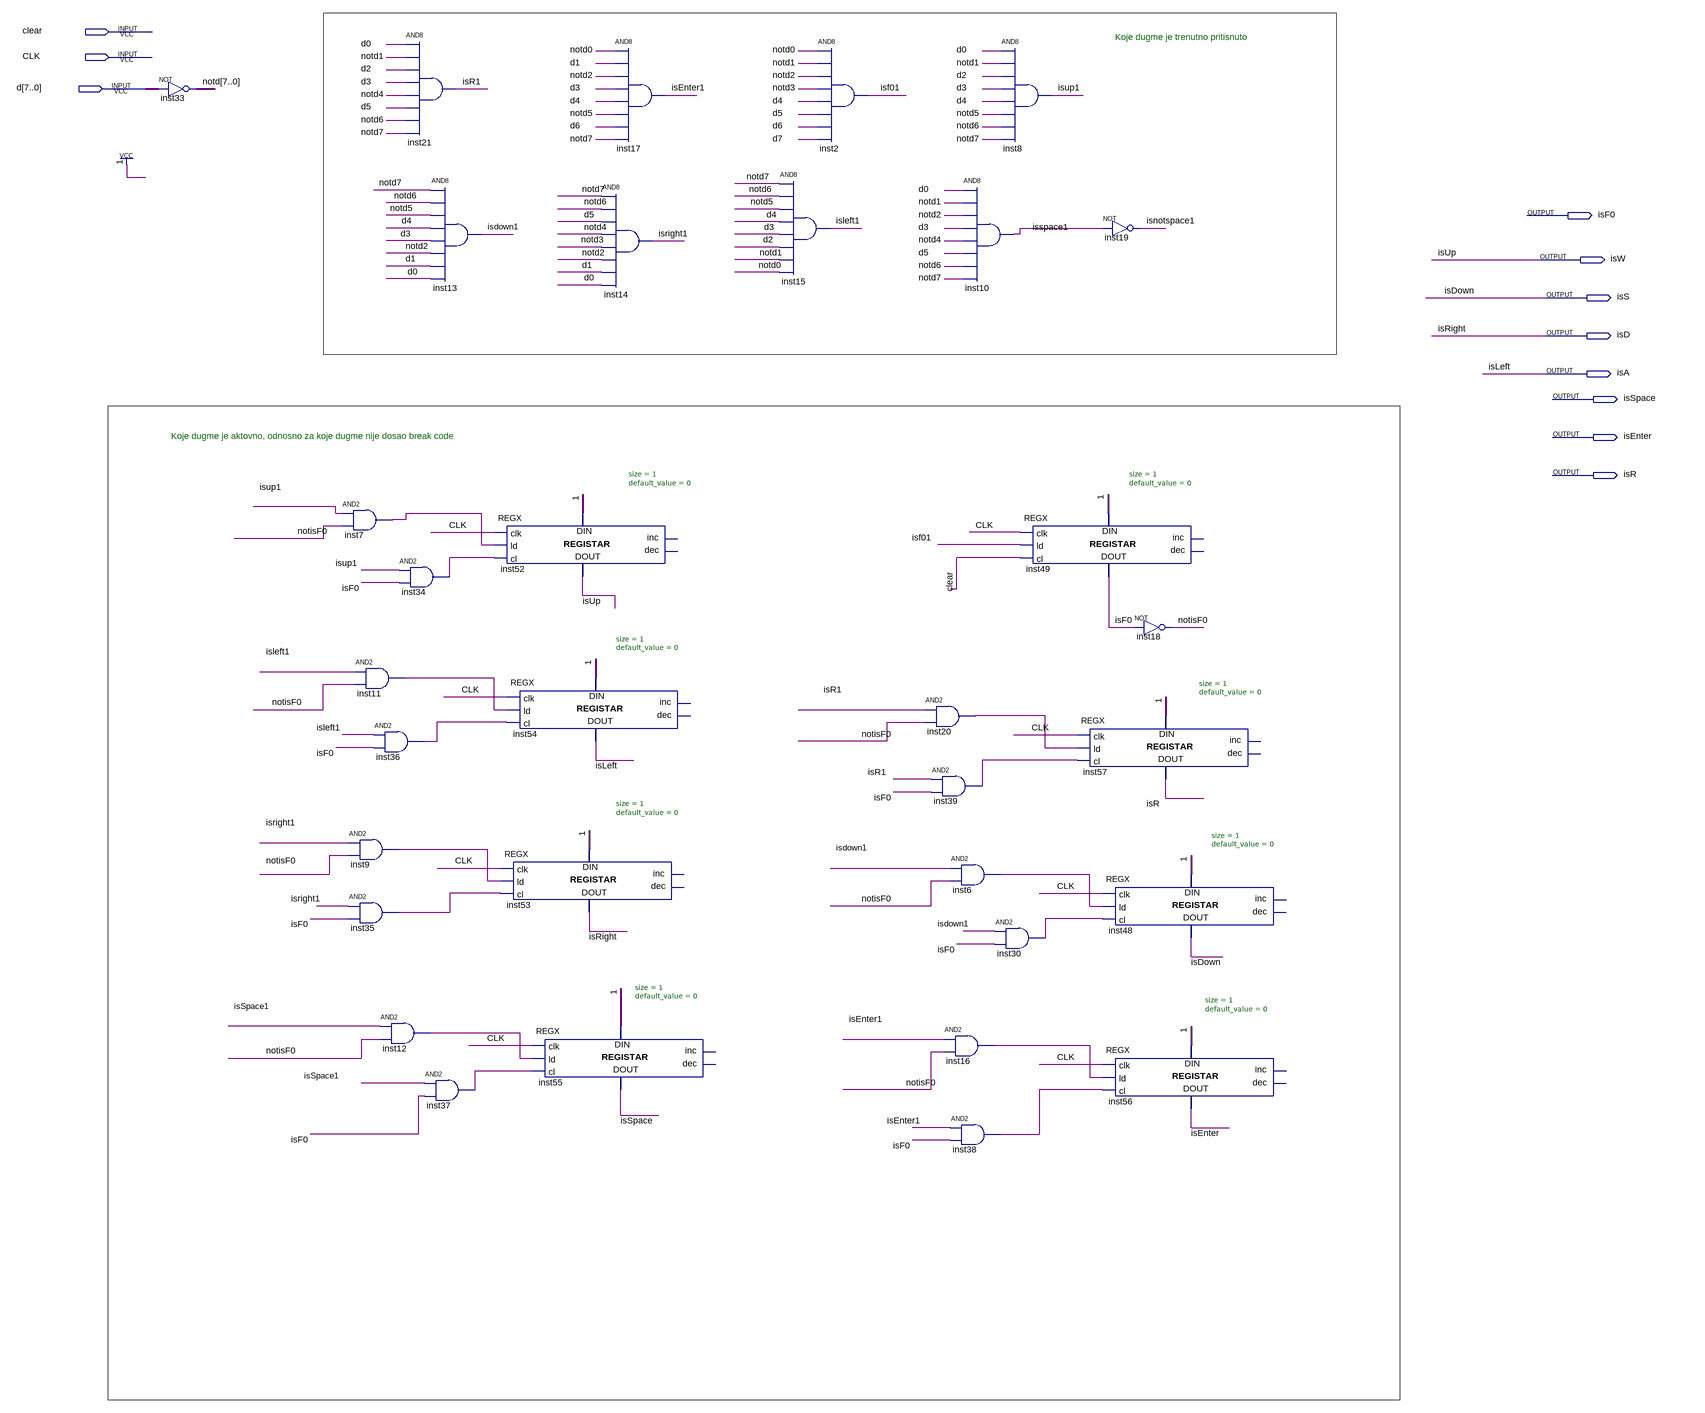
[diagram p0: schematic sheet]
// Quartus schematic KeyDetect.bdf as structural Verilog: 33 symbols, 11 pins
module KeyDetect (
  input  clear,
  input  CLK,
  input  [7:0] d,
  output isF0,
  output isW,
  output isS,
  output isD,
  output isA,
  output isSpace,
  output isEnter,
  output isR
);

  wire inst6_out, inst7_out, inst9_out, inst11_out, inst12_out, inst16_out, inst20_out, inst30_out,
       inst34_out, inst35_out, inst36_out, inst37_out, inst38_out, inst39_out, isdown1, isEnter1, isf01,
       isleft1, isnotspace1, isR1, isright1, isspace1, isup1, notisF0;
  wire [7:0] notd;

  assign notd = ~d;  // NOT inst33, 8 bits wide
  and inst7 (inst7_out, isup1, notisF0);
  and inst11 (inst11_out, isleft1, notisF0);
  and inst36 (inst36_out, isleft1, isF0);
  and inst9 (inst9_out, isright1, notisF0);
  and inst35 (inst35_out, isright1, isF0);
  and inst12 (inst12_out, isspace1, notisF0);
  and inst21 (isR1, d[0], notd[1], d[2], d[3], notd[4], d[5], notd[6], notd[7]);
  and inst13 (isdown1, notd[7], notd[6], notd[5], d[4], d[3], notd[2], d[1], d[0]);
  and inst34 (inst34_out, isup1, isF0);
  and inst37 (inst37_out, isspace1, isF0);
  REGX #(.size(1), .default_value(0)) inst52 (
    .clk(CLK), .ld(inst7_out), .cl(inst34_out), .data_in(1'b1), .data_out(isW));  // open: inc, dec
  REGX #(.size(1), .default_value(0)) inst54 (
    .clk(CLK), .ld(inst11_out), .cl(inst36_out), .data_in(1'b1), .data_out(isA));  // open: inc, dec
  REGX #(.size(1), .default_value(0)) inst53 (
    .clk(CLK), .ld(inst9_out), .cl(inst35_out), .data_in(1'b1), .data_out(isD));  // open: inc, dec
  REGX #(.size(1), .default_value(0)) inst55 (
    .clk(CLK), .ld(inst12_out), .cl(inst37_out), .data_in(1'b1), .data_out(isSpace));  // open: inc, dec
  and inst17 (isEnter1, notd[0], d[1], notd[2], d[3], d[4], notd[5], d[6], notd[7]);
  and inst14 (isright1, notd[7], notd[6], d[5], notd[4], notd[3], notd[2], d[1], d[0]);
  and inst15 (isleft1, notd[7], notd[6], notd[5], d[4], d[3], d[2], notd[1], notd[0]);
  and inst2 (isf01, notd[0], notd[1], notd[2], notd[3], d[4], d[5], d[6], d[7]);
  and inst20 (inst20_out, isR1, notisF0);
  and inst39 (inst39_out, isR1, isF0);
  and inst6 (inst6_out, isdown1, notisF0);
  and inst16 (inst16_out, isEnter1, notisF0);
  and inst38 (inst38_out, isEnter1, isF0);
  and inst8 (isup1, d[0], notd[1], d[2], d[3], d[4], notd[5], notd[6], notd[7]);
  and inst10 (isspace1, d[0], notd[1], notd[2], d[3], notd[4], d[5], notd[6], notd[7]);
  and inst30 (inst30_out, isdown1, isF0);
  REGX #(.size(1), .default_value(0)) inst49 (
    .clk(CLK), .ld(isf01), .cl(clear), .data_in(1'b1), .data_out(isF0));  // open: inc, dec
  not inst19 (isnotspace1, isspace1);
  REGX #(.size(1), .default_value(0)) inst57 (
    .clk(CLK), .ld(inst20_out), .cl(inst39_out), .data_in(1'b1), .data_out(isR));  // open: inc, dec
  REGX #(.size(1), .default_value(0)) inst48 (
    .clk(CLK), .ld(inst6_out), .cl(inst30_out), .data_in(1'b1), .data_out(isS));  // open: inc, dec
  REGX #(.size(1), .default_value(0)) inst56 (
    .clk(CLK), .ld(inst16_out), .cl(inst38_out), .data_in(1'b1), .data_out(isEnter));  // open: inc, dec
  not inst18 (notisF0, isF0);

  // Other names for the same wires on the sheet: isDown = isS; isLeft = isA; isRight = isD; isUp = isW

  // Notes on the sheet:
  //   Koje dugme je trenutno pritisnuto
  //   Koje dugme je aktovno, odnosno za koje dugme nije dosao break code
endmodule
